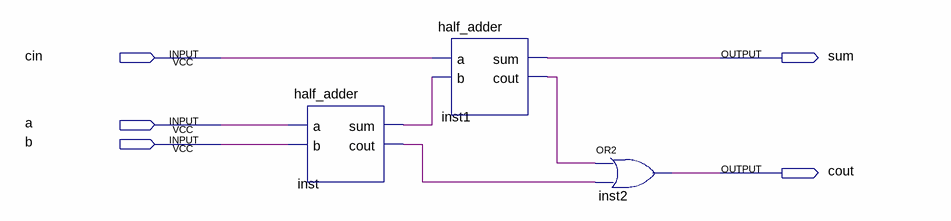
[diagram p0: schematic sheet]
// Quartus schematic full_adder.bdf as structural Verilog: 3 symbols, 5 pins
module full_adder (
  input  cin,
  input  a,
  input  b,
  output sum,
  output cout
);

  wire inst1_cout, inst_cout, inst_sum;

  half_adder inst (.a(a), .b(b), .sum(inst_sum), .cout(inst_cout));
  half_adder inst1 (.a(cin), .b(inst_sum), .sum(sum), .cout(inst1_cout));
  or inst2 (cout, inst1_cout, inst_cout);
endmodule
